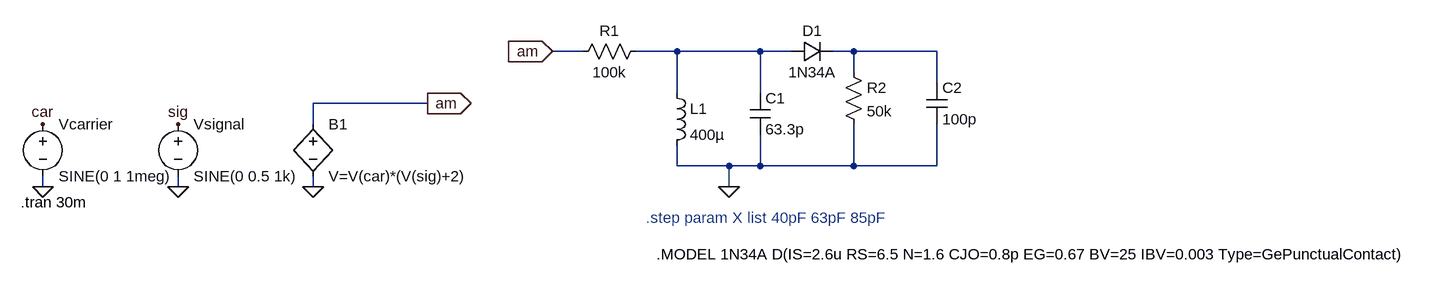
[diagram p0: schematic AM1000_1N34A.asc]
AM1000_1N34A.asc, the LTspice schematic file:
Version 4
SHEET 1 2184 680
WIRE 832 -48 784 -48
WIRE 976 -48 912 -48
WIRE 1104 -48 976 -48
WIRE 1152 -48 1104 -48
WIRE 1248 -48 1216 -48
WIRE 1376 -48 1248 -48
WIRE 1248 -16 1248 -48
WIRE 1376 0 1376 -48
WIRE 976 16 976 -48
WIRE 1104 16 1104 -48
WIRE 592 32 416 32
WIRE 416 64 416 32
WIRE 976 128 976 96
WIRE 1056 128 976 128
WIRE 1104 128 1104 80
WIRE 1104 128 1056 128
WIRE 1248 128 1248 64
WIRE 1248 128 1104 128
WIRE 1376 128 1376 64
WIRE 1376 128 1248 128
WIRE 0 160 0 144
WIRE 208 160 208 144
WIRE 416 160 416 144
WIRE 1056 160 1056 128
FLAG 0 160 0
FLAG 208 160 0
FLAG 0 64 car
FLAG 208 64 sig
FLAG 416 160 0
FLAG 592 32 am
IOPIN 592 32 Out
FLAG 1056 160 0
FLAG 784 -48 am
IOPIN 784 -48 In
SYMBOL voltage 0 48 R0
WINDOW 123 0 0 Left 0
WINDOW 39 0 0 Left 0
SYMATTR InstName Vcarrier
SYMATTR Value SINE(0 1 1meg)
SYMBOL voltage 208 48 R0
WINDOW 123 0 0 Left 0
WINDOW 39 0 0 Left 0
SYMATTR InstName Vsignal
SYMATTR Value SINE(0 0.5 1k)
SYMBOL bv 416 48 R0
SYMATTR InstName B1
SYMATTR Value V=V(car)*(V(sig)+2)
SYMBOL ind 960 0 R0
SYMATTR InstName L1
SYMATTR Value 400µ
SYMBOL cap 1088 16 R0
SYMATTR InstName C1
SYMATTR Value 63.3p
SYMBOL res 928 -64 R90
WINDOW 0 0 56 VBottom 2
WINDOW 3 32 56 VTop 2
SYMATTR InstName R1
SYMATTR Value 100k
SYMBOL res 1232 -32 R0
SYMATTR InstName R2
SYMATTR Value 50k
SYMBOL diode 1152 -32 R270
WINDOW 0 32 32 VTop 2
WINDOW 3 0 32 VBottom 2
SYMATTR InstName D1
SYMATTR Value 1N34A
SYMBOL cap 1360 0 R0
SYMATTR InstName C2
SYMATTR Value 100p
TEXT -34 184 Left 2 !.tran 30m
TEXT 928 208 Left 2 ;.step param X list 40pF 63pF 85pF
TEXT 944 264 Left 2 !.MODEL 1N34A D(IS=2.6u RS=6.5 N=1.6 CJO=0.8p EG=0.67 BV=25 IBV=0.003 Type=GePunctualContact)

The netlist it stands for:
* AM1000_1N34A.asc
Vcarrier car 0 SINE(0 1 1meg)
Vsignal sig 0 SINE(0 0.5 1k)
B1 am 0 V=V(car)*(V(sig)+2)
L1 N001 0 400µ
C1 N001 0 63.3p
R1 N001 am 100k
R2 N002 0 50k
D1 N001 N002 1N34A
C2 N002 0 100p
.model D D
.lib standard.dio
.tran 30m
* .step param X list 40pF 63pF 85pF
.MODEL 1N34A D(IS=2.6u RS=6.5 N=1.6 CJO=0.8p EG=0.67 BV=25 IBV=0.003 Type=GePunctualContact)
.backanno
.end